# EAGLE schematic bootloadHID_sch (EAGLE 7.6.0)
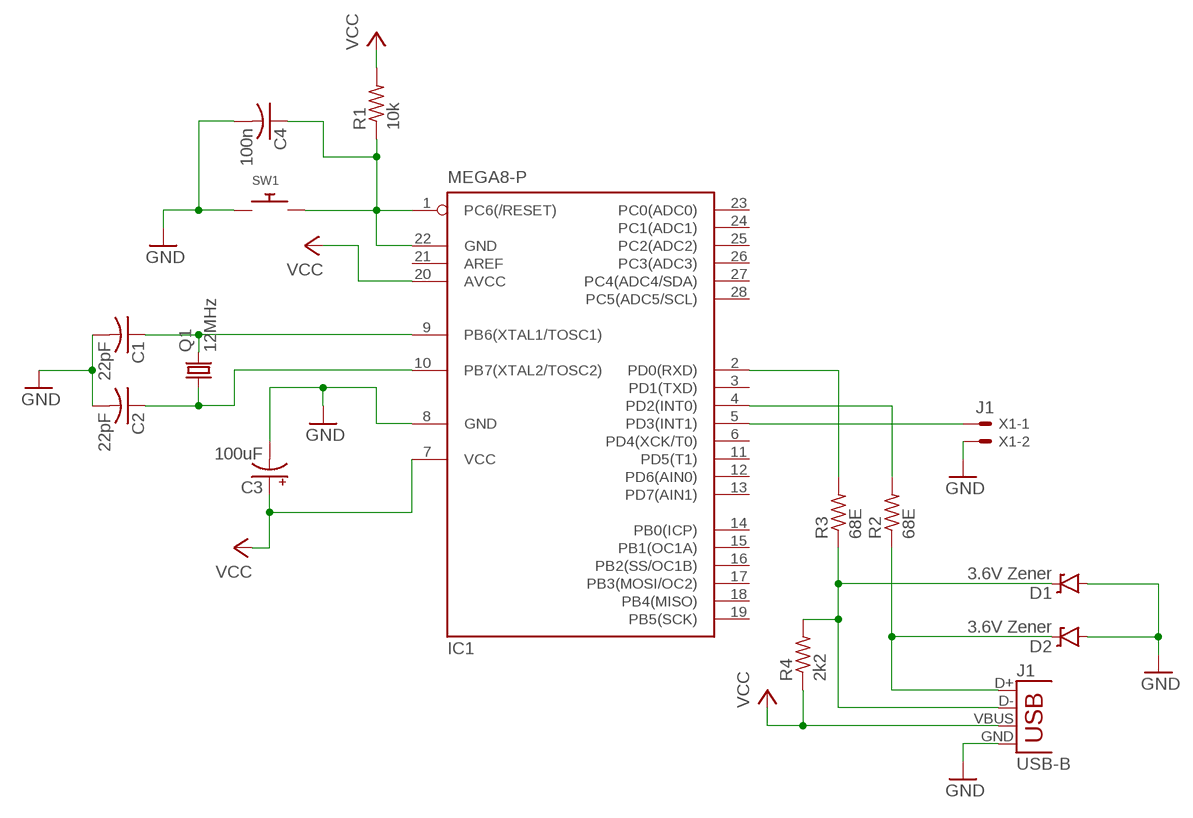
[diagram p0: schematic, sheet 1]

## Parts
C1  22pF  C-US050-024X044  [C050-024X044]
C2  22pF  C-US050-024X044  [C050-024X044]
C3  100uF  CPOL-USE2.5-6  [E2,5-6]
C4  100n  C-US050-024X044  [C050-024X044]
D1  3.6V Zener  DIODE-ZENER  [DIODE-BZT52]
D2  3.6V Zener  DIODE-ZENER  [DIODE-BZT52]
IC1  MEGA8-P  [DIL28-3]
J1  USB-B  USBPTH  [USB-B-PTH]
Q1  12MHz  CRYSTALHC49S  [HC49/S]
R1  10k  R-US_0204/7  [0204/7]
R2  68E  R-US_0204/7  [0204/7]
R3  68E  R-US_0204/7  [0204/7]
R4  2k2  R-US_0204/7  [0204/7]
SW1  SWITCH_PUSHBUTTONEVQ-PE  [TACT_PANA-EVQ]
X1  J1  22-23-2021  [22-23-2021]

## Nets
GND: C1.2 C2.2 C3.- C4.2 D1.A D2.A IC1.8(GND) J1.GND SW1.P$1 X1.2
N$1: C2.1 IC1.10(PB7(XTAL2/TOSC2)) Q1.1
N$2: C1.1 IC1.9(PB6(XTAL1/TOSC1)) Q1.2
N$3: D1.C J1.D- R3.1 R4.2
N$4: IC1.2(PD0(RXD)) R3.2
N$5: D2.C J1.D+ R2.1
N$6: IC1.4(PD2(INT0)) R2.2
N$7: C4.1 IC1.1(PC6(/RESET)) IC1.22(GND) R1.1 SW1.P$2
N$9: IC1.5(PD3(INT1)) X1.1
VCC: C3.+ IC1.7(VCC) IC1.20(AVCC) J1.VBUS R1.2 R4.1
Unconnected: IC1.3(PD1(TXD)) IC1.6(PD4(XCK/T0)) IC1.11(PD5(T1)) IC1.12(PD6(AIN0)) IC1.13(PD7(AIN1)) IC1.14(PB0(ICP)) IC1.15(PB1(OC1A)) IC1.16(PB2(SS/OC1B)) IC1.17(PB3(MOSI/OC2)) IC1.18(PB4(MISO)) IC1.19(PB5(SCK)) IC1.21(AREF) IC1.23(PC0(ADC0)) IC1.24(PC1(ADC1)) IC1.25(PC2(ADC2)) IC1.26(PC3(ADC3)) IC1.27(PC4(ADC4/SDA)) IC1.28(PC5(ADC5/SCL))

## Library data of the parts
C1 C2 C4 = adafruit:C-US: CAPACITOR, American symbol
C3 = adafruit:CPOL-US: POLARIZED CAPACITOR, American symbol
D1 D2 = SparkFun-DiscreteSemi:DIODE-ZENER: Zener Diode Production Part - 8199 3.4V Zener Voltage; PROD-ID: DIO-08199; VALUE: BZT52
IC1 = atmel:MEGA8-P: MICROCONTROLLER 8 Kbytes FLASH, 1 kbytes SRAM, 512 bytes EEPROM, USART, 4-channel 10 bit ADC, 2-channel 8 bit ADC Pin compatible with Atmega48, ATMega88, ATMega168 Source: avr.lbr; OC_FARNELL: unknown; OC_NEWARK: unknown
J1 = SparkFun-Connectors:USB: USB Connectors USB-B-PTH is fully proven SKU : PRT-00139/CONN-08278 USB-miniB is fully proven SKU : PRT-00587 USB-A-PCB is untested. USB-A-H is throughly reviewed, but untested. Spark Fun Electronics SKU : PRT-00437 USB-B-SMT is throughly reviewed, but untested. Needs silkscreen touching up. USB-A-S has not been used/tested USB-MB-H has not been used/tested USB-MICROB has been used. CONN-09505; PROD_ID: CONN-08278
Q1 = adafruit:CRYSTAL: CRYSTAL; OC_FARNELL: 1667008; OC_NEWARK: unknown
R1-R4 = adafruit:R-US_: RESISTOR, American symbol
SW1 = adafruit:SWITCH_PUSHBUTTON: Buttons SOFTTOUCHSMD_SJ - Soft touch temporary push button (Super Junk Akihabara) Compatible with SKPMANE010 [Mouser: 688-SKPMAN] C&K_KSS = Digikey: KSS221GLFS
X1 = con-molex:22-23-2021: .100" (2.54mm) Center Header - 2 Pin; MF: MOLEX; MPN: 22-23-2021; OC_FARNELL: 1462926; OC_NEWARK: 25C3832